# Altium schematic sheet [6]RS232_Debug.SchDoc
size A4
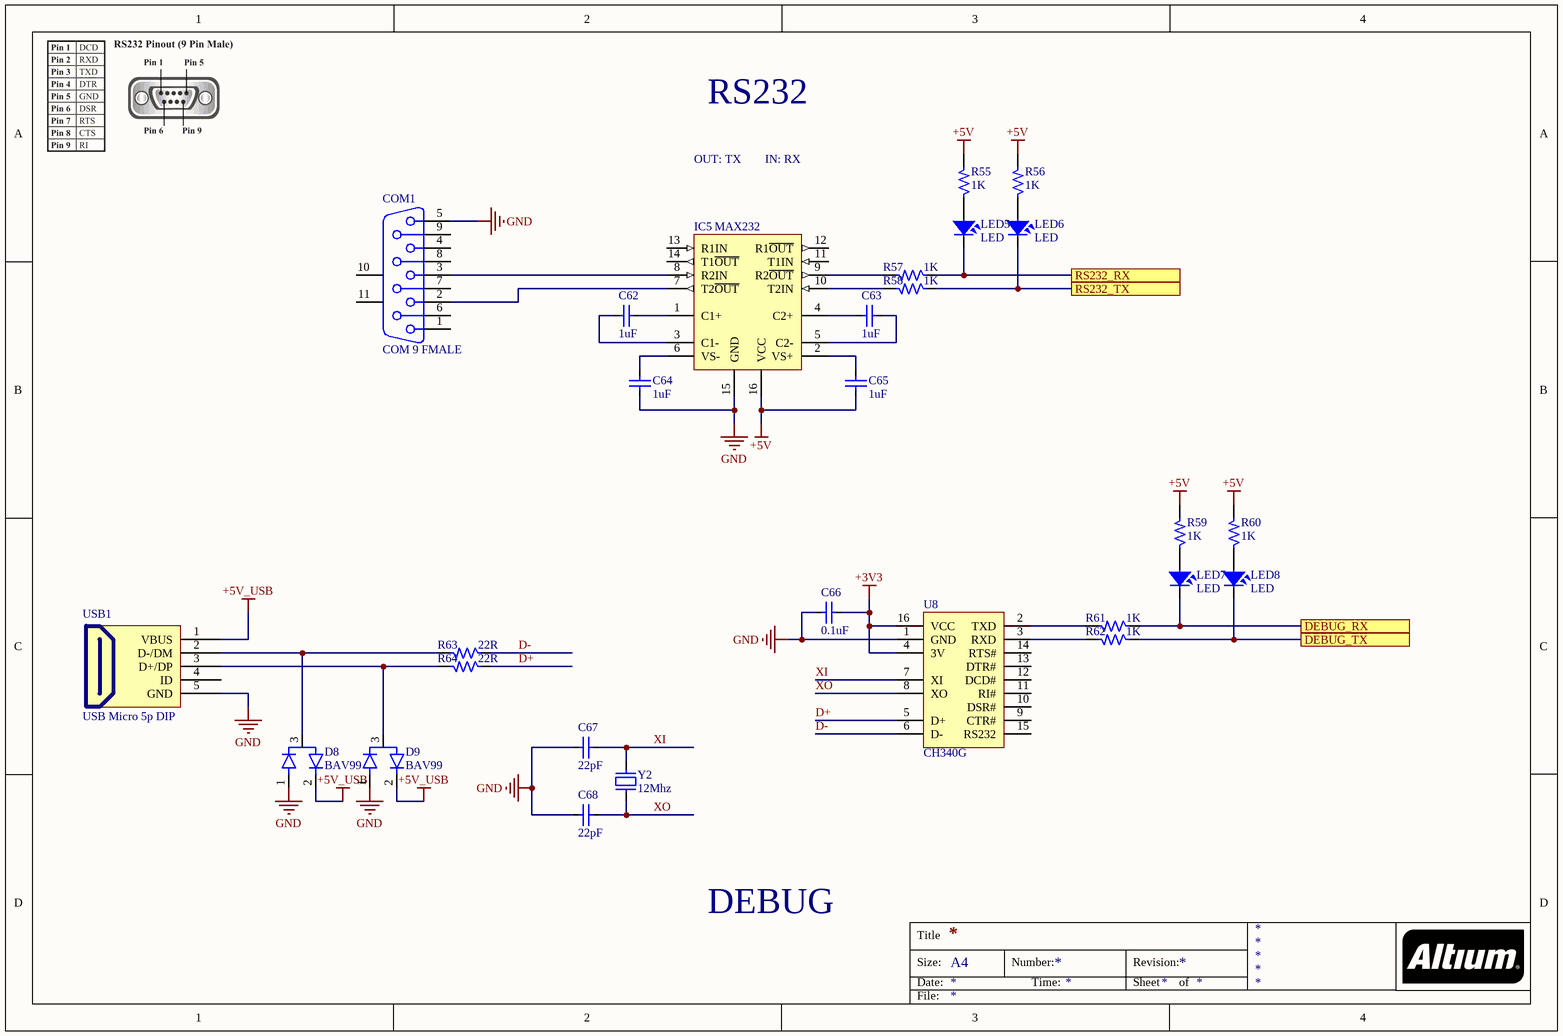
[diagram p0: [6]RS232_Debug.SchDoc]

## Parts
C62  1uF  [CAP_0805]
C63  1uF  [CAP_0805]
C64  1uF  [CAP_0805]
C65  1uF  [CAP_0805]
C66  0.1uF  [CAP_0805]
C67  22pF  [CAP_0805]
C68  22pF  [CAP_0805]
COM1  COM 9 FMALE  [DSB 9-F]
D8  BAV99  [DIO_BAV99]
D9  BAV99  [DIO_BAV99]
IC5  MAX232  [MAX232DR]
LED5  LED  [LED-0805-Blue]
LED6  LED  [LED-0805-Blue]
LED7  LED  [LED-0805-Blue]
LED8  LED  [LED-0805-Blue]
R55  1K  [R0805]
R56  1K  [R0805]
R57  1K  [R0805]
R58  1K  [R0805]
R59  1K  [R0805]
R60  1K  [R0805]
R61  1K  [R0805]
R62  1K  [R0805]
R63  22R  [R0805]
R64  22R  [R0805]
U8  CH340G  [SO16]
USB1  USB Micro 5p DIP  [USB Micro 5p DIP]
Y2  12Mhz  [Thach Anh 2 chan SMD5032]

## Ports
DEBUG_RX, DEBUG_TX, RS232_RX, RS232_TX

## Nets
+3V3: C66.1 U8.4(3V) U8.16(VCC)
+5V: C65.2 IC5.16(VCC) R55.2 R56.2 R59.2 R60.2
+5V_USB: D8.2 D9.2 USB1.1(VBUS)
GND: C64.2 C66.2 C67.2 C68.2 COM1.5 D8.1 D9.1 IC5.15(GND) U8.1(GND) USB1.5(GND)
D+: R64.1 U8.5(D+)
D-: R63.1 U8.6(D-)
DEBUG_RX: LED7.2 R61.1 ; port DEBUG_RX
DEBUG_TX: LED8.2 R62.1 ; port DEBUG_TX
RS232_RX: LED5.2 R57.1 ; port RS232_RX
RS232_TX: LED6.2 R58.1 ; port RS232_TX
XI: C67.1 U8.7(XI) Y2.1
XO: C68.1 U8.8(XO) Y2.2
NetC62_1: C62.1 IC5.1(C1+)
NetC62_2: C62.2 IC5.3(C1-)
NetC63_1: C63.1 IC5.5(C2-)
NetC63_2: C63.2 IC5.4(C2+)
NetC64_1: C64.1 IC5.6(VS-)
NetC65_1: C65.1 IC5.2(VS+)
NetCOM1_2: COM1.2 IC5.7(T2~{OUT})
NetCOM1_3: COM1.3 IC5.8(R2IN)
NetD8_3: D8.3 R63.2 USB1.2(D-/DM)
NetD9_3: D9.3 R64.2 USB1.3(D+/DP)
NetIC5_9: IC5.9(R2~{OUT}) R57.2
NetIC5_10: IC5.10(T2IN) R58.2
NetLED5_1: LED5.1 R55.1
NetLED6_1: LED6.1 R56.1
NetLED7_1: LED7.1 R59.1
NetLED8_1: LED8.1 R60.1
NetR61_2: R61.2 U8.2(TXD)
NetR62_2: R62.2 U8.3(RXD)

Not connected (* = marked no-connect by the designer): COM1 1 4 6 7 8 9 10(MH1) 11(MH2); IC5 11(T1IN) 12(R1~{OUT}) 13(R1IN) 14(T1~{OUT}); U8 9(CTR#) 10(DSR#) 11(RI#) 12(DCD#) 13(DTR#) 14(RTS#) 15(RS232); USB1 4(ID)

## Notes on the sheet
- RS232
- OUT: TX        IN: RX
- DEBUG
- Title
- Size:
- Date:
- A4
- Number:
- Time:
- Revision:
- Sheet
- of
- File:

## Library data of the parts
C62-C68 = CapSMD: Capacitor; Value: 33p; Published: 8-Jun-2000; LatestRevisionDate: 17-Jul-2002; LatestRevisionNote: Re-released for DXP Platform.; PackageReference: RAD-0.3; Publisher: Altium Limited
COM1 = DSB9F: COM 9; PackageDocument: O; Positions: 9; Gender: Receptacle; Value: COM 9; Published: 15-Jun-2001; LatestRevisionDate: 17-Jul-2002; LatestRevisionNote: Re-released for DXP Platform.; DatasheetDocument: 1-Sep-1999; PackageReference: 788750; Publisher: Altium Limited; Orientation: Right Angle
D8 D9 = BAV99: Diode Array 1 Pair Series Connection Standard 100V 215mA (DC) Surface Mount TO-236-3, SC-59, SOT-23-3; MF: ON Semiconductor; Price: None; Availability: In Stock; MP: BAV99; Package: SOT-23-3 Motorola; SnapEDA_Link: https://www.snapeda.com/parts/BAV99/Onsemi/view-part/?ref=snap; Check_prices: https://www.snapeda.com/parts/BAV99/Onsemi/view-part/?ref=eda; Value: *; Purchase-URL: https://pricing.snapeda.com/search/part/BAV99/?ref=eda
IC5 = MAX232: Dual EIA-232 Driver/Receiver; Value: MAX232
LED5-LED8 = LED: LED Single colour Green and Red; Value: LED 3 ly Single Colour
R55-R62 = RM: Resistor SMD; Value: 1K
R63 R64 = RM: Resistor SMD; Value: 1K
U8 = CH340G: High and Low Side Driver; Note: Pins 4, 8 and 14 are not connected; Published: 8-Jun-2000; LatestRevisionDate: 04-Mar-2005; LatestRevisionNote: Stylized 3D Model Added.; DatasheetVersion: PD60147J; PackageReference: PDIP14; Publisher: Altium Limited; PackageDescription: DIP; 14 Leads; Row Spacing 7.62 mm; Pitch 2.54 mm; ComponentLink1Description: Manufacturer Link; ComponentLink1URL: http://www.irf.com/; ComponentLink2Description: Datasheet; ComponentLink2URL: http://www.irf.com/product-info/datasheets/data/ir2110.pdf
USB1 = USB Micro 5p DIP: USB Type B; Ten: MicroUSB MK5P DIP; Ma_Hang: MH005145
Y2 = Thach Anh 2 chan SMD 5032: Crystal For all Crystal 2pin.; Value: 4Mhz